# EAGLE schematic hw2 (EAGLE 8.1.0)
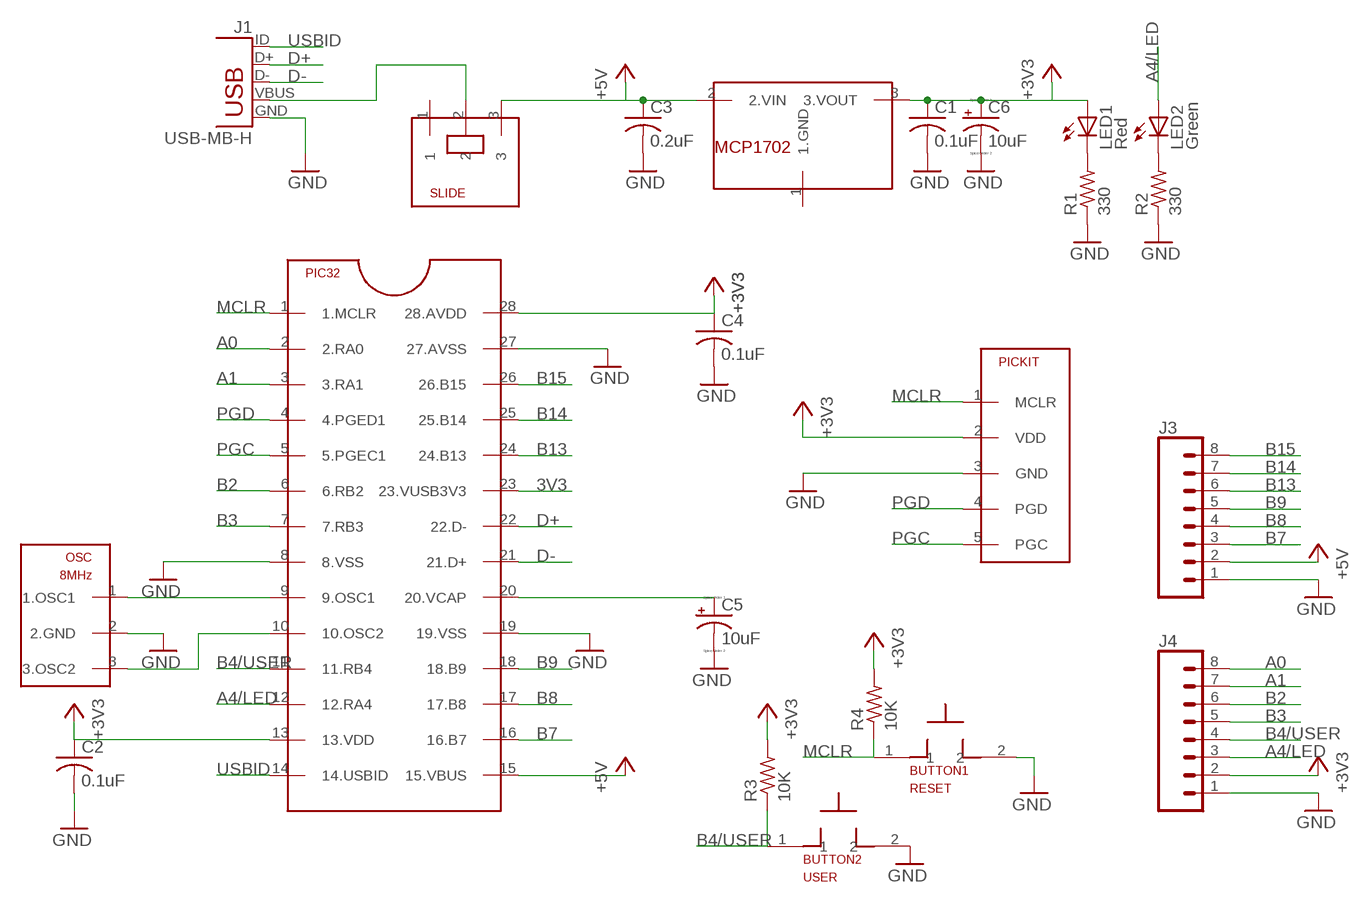
[diagram p0: schematic, sheet 1]

## Parts
BUTTON1  RESET  PB  [PB]
BUTTON2  USER  PB  [PB]
C1  0.1uF  C-US025-025X050  [C025-025X050]
C2  0.1uF  C-US025-025X050  [C025-025X050]
C3  0.2uF  C-US025-025X050  [C025-025X050]
C4  0.1uF  C-US025-025X050  [C025-025X050]
C5  10uF  CPOL-USB45181B  [B45181B]
C6  10uF  CPOL-USB45181B  [B45181B]
J1  USB-MB-H  [USB-MB-H]
J3  CONN_08_01  [1X08]
J4  CONN_08_01  [1X08]
LED1  Red  LED3MM  [LED3MM]
LED2  Green  LED3MM  [LED3MM]
MCP1702  MCP1702  [TO92]
OSC  8MHz  OSC  [OSC]
PIC32  PIC32  [DIL28-3]
PICKIT  PICKIT  [1X05]
R1  330  R-US_0207/10  [0207/10]
R2  330  R-US_0207/10  [0207/10]
R3  10K  R-US_0207/10  [0207/10]
R4  10K  R-US_0207/10  [0207/10]
SLIDE  SLIDE  [SLIDE]

## Nets
3V3: PIC32.23(23.VUSB3V3)
+3V3: C1.1 C2.1 C4.1 C6.+ J4.2 LED1.A MCP1702.3(3.VOUT) PIC32.13(13.VDD) PIC32.28(28.AVDD) PICKIT.2(VDD) R3.2 R4.2
+5V: C3.1 J3.2 MCP1702.2(2.VIN) PIC32.15(15.VBUS) SLIDE.3
A0: J4.8 PIC32.2(2.RA0)
A1: J4.7 PIC32.3(3.RA1)
A4/LED: J4.3 LED2.A PIC32.12(12.RA4)
B2: J4.6 PIC32.6(6.RB2)
B3: J4.5 PIC32.7(7.RB3)
B4/USER: BUTTON2.1 J4.4 PIC32.11(11.RB4) R3.1
B7: J3.3 PIC32.16(16.B7)
B8: J3.4 PIC32.17(17.B8)
B9: J3.5 PIC32.18(18.B9)
B13: J3.6 PIC32.24(24.B13)
B14: J3.7 PIC32.25(25.B14)
B15: J3.8 PIC32.26(26.B15)
D+: J1.D+ PIC32.22(22.D-)
D-: J1.D- PIC32.21(21.D+)
GND: BUTTON1.2 BUTTON2.2 C1.2 C2.2 C3.2 C4.2 C5.- C6.- J1.GND J3.1 J4.1 OSC.2(2.GND) PIC32.8(8.VSS) PIC32.19(19.VSS) PIC32.27(27.AVSS) PICKIT.3(GND) R1.1 R2.1
MCLR: BUTTON1.1 PIC32.1(1.MCLR) PICKIT.1(MCLR) R4.1
N$1: J1.VBUS SLIDE.2
N$2: OSC.1(1.OSC1) PIC32.9(9.OSC1)
N$3: LED1.K(C) R1.2
N$4: LED2.K(C) R2.2
N$5: OSC.3(3.OSC2) PIC32.10(10.OSC2)
N$6: C5.+ PIC32.20(20.VCAP)
PGC: PIC32.5(5.PGEC1) PICKIT.5(PGC)
PGD: PIC32.4(4.PGED1) PICKIT.4(PGD)
USBID: J1.ID PIC32.14(14.USBID)
Unconnected: MCP1702.1(1.GND) SLIDE.1

## Library data of the parts
BUTTON1 BUTTON2 = HW2LIB:PB
C1-C4 = HW2LIB:C-US: CAPACITOR, American symbol
C5 C6 = HW2LIB:CPOL-US: POLARIZED CAPACITOR, American symbol
J1 = HW2LIB:USB: USB Connectors USB-B-PTH is fully proven SKU : PRT-00139/CONN-08278 USB-miniB is fully proven SKU : PRT-00587 USB-A-PCB is untested. USB-A-H is throughly reviewed, but untested. Spark Fun Electronics SKU : PRT-00437 USB-B-SMT is throughly reviewed, but untested. Needs silkscreen touching up. USB-A-S has not been used/tested USB-MB-H has not been used/tested USB-MICROB has been used. CONN-09505
J3 J4 = HW2LIB:CONN_08_01
LED1 LED2 = HW2LIB:LED: LED OSRAM: - CHIPLED LG R971, LG N971, LY N971, LG Q971, LY Q971, LO R971, LY R971 LH N974, LH R974 LS Q976, LO Q976, LY Q976 LO Q996 - Hyper CHIPLED LW Q18S LB Q993, LB Q99A, LB R99A - SideLED LS A670, LO A670, LY A670, LG A670, LP A670 LB A673, LV A673, LT A673, LW A673 LH A674 LY A675 LS A676, LA A676, LO A676, LY A676, LW A676 LS A679, LY A679, LG A679 - Hyper Micro SIDELED® LS Y876, LA Y876, LO Y876, LY Y876 LT Y87S - SmartLED LW L88C, LW L88S LB L89C, LB L89S, LG L890 LS L89K, LO L89K, LY L89K LS L896, LA L896, LO L896, LY L896 - TOPLED LS T670, LO T670, LY T670, LG T670, LP T670 LSG T670, LSP T670, LSY T670, LOP T670, LYG T670 LG T671, LOG T671, LSG T671 LB T673, LV T673, LT T673, LW T673 LH T674 LS T676, LA T676, LO T676, LY T676, LB T676, LH T676, LSB T676, LW T676 LB T67C, LV T67C, LT T67C, LS T67K, LO T67K, LY T67K, LW E67C LS E67B, LA E67B, LO E67B, LY E67B, LB E67C, LV E67C, LT E67C LW T67C LS T679, LY T679, LG T679 LS T770, LO T770, LY T770, LG T770, LP T770 LB T773, LV T773, LT T773, LW T773 LH T774 LS E675, LA E675, LY E675, LS T675 LS T776, LA T776, LO T776, LY T776, LB T776 LHGB T686 LT T68C, LB T68C - Hyper Mini TOPLED® LB M676 - Mini TOPLED Santana® LG M470 LS M47K, LO M47K, LY M47K Source: http://www.osram.convergy.de LUXEON: - LUMILED® LXK2-PW12-R00, LXK2-PW12-S00, LXK2-PW14-U00, LXK2-PW14-V00 LXK2-PM12-R00, LXK2-PM12-S00, LXK2-PM14-U00 LXK2-PE12-Q00, LXK2-PE12-R00, LXK2-PE12-S00, LXK2-PE14-T00, LXK2-PE14-U00 LXK2-PB12-K00, LXK2-PB12-L00, LXK2-PB12-M00, LXK2-PB14-N00, LXK2-PB14-P00, LXK2-PB14-Q00 LXK2-PR12-L00, LXK2-PR12-M00, LXK2-PR14-Q00, LXK2-PR14-R00 LXK2-PD12-Q00, LXK2-PD12-R00, LXK2-PD12-S00 LXK2-PH12-R00, LXK2-PH12-S00 LXK2-PL12-P00, LXK2-PL12-Q00, LXK2-PL12-R00 Source: www.luxeon.com KINGBRIGHT: KA-3528ASYC Source: www.kingbright.com
MCP1702 = HW2LIB:MCP1702
OSC = HW2LIB:OSC
PIC32 = HW2LIB:PIC32
PICKIT = HW2LIB:PICKIT
R1-R4 = HW2LIB:R-US_: RESISTOR, American symbol
SLIDE = HW2LIB:SLIDE